# Altium schematic sheet BSPD.SchDoc
size A4; SheetNumber: 1; SheetTotal: 1
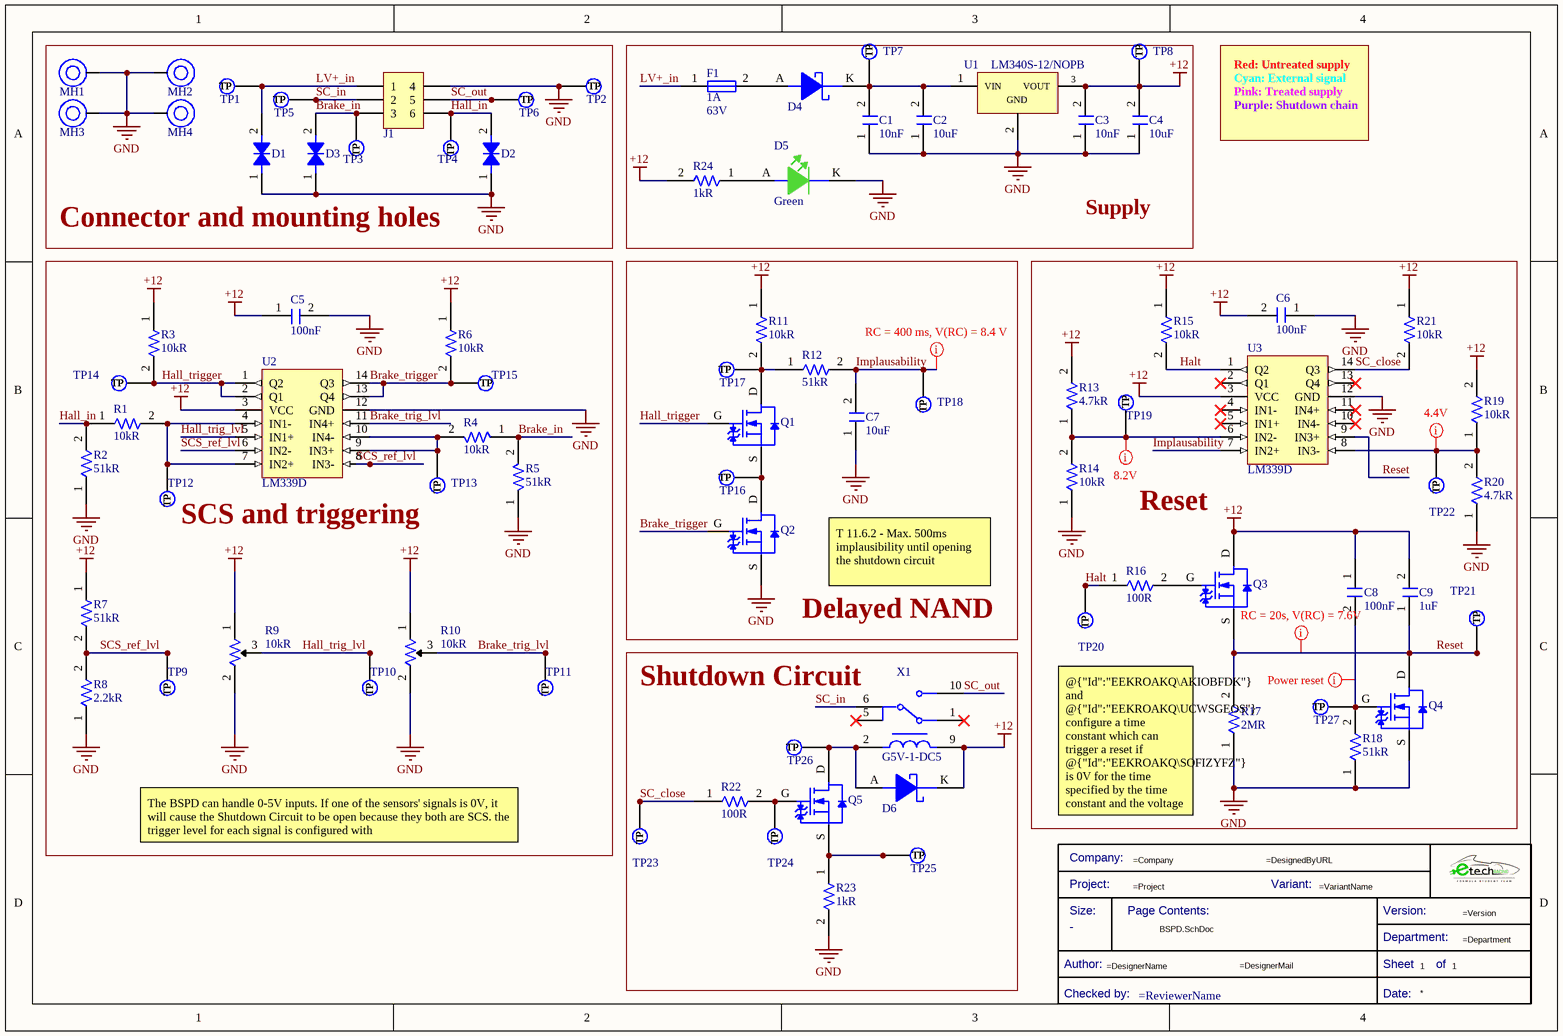
[diagram p0: BSPD.SchDoc]

## Parts
*  Title Block_template  (value not drawn)  (graphical)
C1  Capacitance: 10nF  [C1206FNPC-RW]  (hidden comment: 885012008055)
C2  Capacitance: 10uF  [C10u-50V-1210FNPMLCC-X7R]  (hidden comment: GRJ32ER71H106KE11L)
C3  Capacitance: 10nF  [C1206FNPC-RW]  (hidden comment: 885012008055)
C4  Capacitance: 10uF  [C10u-50V-1210FNPMLCC-X7R]  (hidden comment: GRJ32ER71H106KE11L)
C5  Capacitance: 100nF  [C1206FNPC-RW]  (hidden comment: 885012208058)
C6  Capacitance: 100nF  [C1206FNPC-RW]  (hidden comment: 885012208058)
C7  Capacitance: 10uF  [C1206FNPC-RW]  (hidden comment: 885012208018)
C8  Capacitance: 100nF  [C1206FNPC-RW]  (hidden comment: 885012208058)
C9  Capacitance: 1uF  [C1206FNPC-RW]  (hidden comment: 885012208036)
D1  824551301  [DTVS-DO-214AB]  (value not drawn)
D2  824501600  [DTVS-DO-214AC]  (value not drawn)
D3  824501600  [DTVS-DO-214AC]  (value not drawn)
D4  MBR0530  [DSC-SOD123]  (value not drawn)
D5  Color: Green  [LED_0805_WE]  (hidden comment: 150080VS75000)
D6  MBR0530  [DSC-SOD123]  (value not drawn)
F1  Current Rating: 1A  Voltage Rating (DC): 63V  [Fuse_1206]  (hidden comment: 0437001.WRA)
J1  J_NanoFit_2x3  [J_NanoFit_2x3]  (value not drawn)
MH1  Mounting_Hole_M3  [Mounting_Hole_M3]  (value not drawn)
MH2  Mounting_Hole_M3  [Mounting_Hole_M3]  (value not drawn)
MH3  Mounting_Hole_M3  [Mounting_Hole_M3]  (value not drawn)
MH4  Mounting_Hole_M3  [Mounting_Hole_M3]  (value not drawn)
Q1  CPH3455-TL-H  [TRT-NCH-3/35-CPH]  (value not drawn)
Q2  CPH3455-TL-H  [TRT-NCH-3/35-CPH]  (value not drawn)
Q3  CPH3455-TL-H  [TRT-NCH-3/35-CPH]  (value not drawn)
Q4  CPH3455-TL-H  [TRT-NCH-3/35-CPH]  (value not drawn)
Q5  CPH3455-TL-H  [TRT-NCH-3/35-CPH]  (value not drawn)
R1  Resistance: 10kR  [R1206FTK-W]  (hidden comment: CRCW120610K0FKEA)
R2  Resistance: 51kR  [R1206FTK-W]  (hidden comment: CRCW120610K0FKEA)
R3  Resistance: 10kR  [R1206FTK-W]  (hidden comment: CRCW120610K0FKEA)
R4  Resistance: 10kR  [R1206FTK-W]  (hidden comment: CRCW120610K0FKEA)
R5  Resistance: 51kR  [R1206FTK-W]  (hidden comment: CRCW120610K0FKEA)
R6  Resistance: 10kR  [R1206FTK-W]  (hidden comment: CRCW120610K0FKEA)
R7  Resistance: 51kR  [R1206FTK-W]  (hidden comment: CRCW120610K0FKEA)
R8  Resistance: 2.2kR  [R1206FTK-W]  (hidden comment: CR1206-FX-2201ELF)
R9  Resistance: 10kR  [R10k-VTR]  (hidden comment: 3296W-1-103LF)
R10  Resistance: 10kR  [R10k-VTR]  (hidden comment: 3296W-1-103LF)
R11  Resistance: 10kR  [R1206FTK-W]  (hidden comment: CRCW120610K0FKEA)
R12  Resistance: 51kR  [R1206FTK-W]  (hidden comment: CRCW120610K0FKEA)
R13  Resistance: 4.7kR  [R1206FTK-W]  (hidden comment: CRS1206-FX-4701ELF)
R14  Resistance: 10kR  [R1206FTK-W]  (hidden comment: CRCW120610K0FKEA)
R15  Resistance: 10kR  [R1206FTK-W]  (hidden comment: CRCW120610K0FKEA)
R16  Resistance: 100R  [R1206FTK-W]  (hidden comment: CRG1206F100R)
R17  Resistence: 2MR  [R1206FTK-W]  (hidden comment: HVC1206-2M0FT3)
R18  Resistance: 51kR  [R1206FTK-W]  (hidden comment: CRCW120610K0FKEA)
R19  Resistance: 10kR  [R1206FTK-W]  (hidden comment: CRCW120610K0FKEA)
R20  Resistance: 4.7kR  [R1206FTK-W]  (hidden comment: CRS1206-FX-4701ELF)
R21  Resistance: 10kR  [R1206FTK-W]  (hidden comment: CRCW120610K0FKEA)
R22  Resistance: 100R  [R1206FTK-W]  (hidden comment: CRG1206F100R)
R23  Resistance: 1kR  [R1206FTK-W]  (hidden comment: ERJT08J102V)
R24  Resistance: 1kR  [R0805FTK]  (hidden comment: CR0805-JW-102ELF)
TP1  TestPoint  [TestPoint]  (value not drawn)  (no BOM)
TP2  TestPoint  [TestPoint]  (value not drawn)  (no BOM)
TP3  TestPoint  [TestPoint]  (value not drawn)  (no BOM)
TP4  TestPoint  [TestPoint]  (value not drawn)  (no BOM)
TP5  TestPoint  [TestPoint]  (value not drawn)  (no BOM)
TP6  TestPoint  [TestPoint]  (value not drawn)  (no BOM)
TP7  TestPoint  [TestPoint]  (value not drawn)  (no BOM)
TP8  TestPoint  [TestPoint]  (value not drawn)  (no BOM)
TP9  TestPoint  [TestPoint]  (value not drawn)  (no BOM)
TP10  TestPoint  [TestPoint]  (value not drawn)  (no BOM)
TP11  TestPoint  [TestPoint]  (value not drawn)  (no BOM)
TP12  TestPoint  [TestPoint]  (value not drawn)  (no BOM)
TP13  TestPoint  [TestPoint]  (value not drawn)  (no BOM)
TP14  TestPoint  [TestPoint]  (value not drawn)  (no BOM)
TP15  TestPoint  [TestPoint]  (value not drawn)  (no BOM)
TP16  TestPoint  [TestPoint]  (value not drawn)  (no BOM)
TP17  TestPoint  [TestPoint]  (value not drawn)  (no BOM)
TP18  TestPoint  [TestPoint]  (value not drawn)  (no BOM)
TP19  TestPoint  [TestPoint]  (value not drawn)  (no BOM)
TP20  TestPoint  [TestPoint]  (value not drawn)  (no BOM)
TP21  TestPoint  [TestPoint]  (value not drawn)  (no BOM)
TP22  TestPoint  [TestPoint]  (value not drawn)  (no BOM)
TP23  TestPoint  [TestPoint]  (value not drawn)  (no BOM)
TP24  TestPoint  [TestPoint]  (value not drawn)  (no BOM)
TP25  TestPoint  [TestPoint]  (value not drawn)  (no BOM)
TP26  TestPoint  [TestPoint]  (value not drawn)  (no BOM)
TP27  TestPoint  [TestPoint]  (value not drawn)  (no BOM)
U1  LM340S-12/NOPB  [LDO_35V-1/12V-TO220]
U2  LM339D  [Array_4_Amp_LM339D]
U3  LM339D  [Array_4_Amp_LM339D]
X1  G5V-1-DC5  [Relay_G5V-1-DC5]

## Blocks framed on the sheet
Connector and mounting holes: D1-D3 J1 MH1-MH4 TP1-TP6
Supply: C1-C4 D4 D5 F1 R24 TP7 TP8 U1
SCS and triggering: C5 R1-R10 TP9-TP15 U2
Delayed NAND: C7 Q1 Q2 R11 R12 TP16-TP18
Reset: C6 C8 C9 Q3 Q4 R13-R21 TP19-TP22 TP27 U3
Shutdown Circuit: D6 Q5 R22 R23 TP23-TP26 X1

## Nets
+12: C3.2 C4.2 C5.1 C6.2 C8.1 C9.2 D6.K Q3.D R3.1 R6.1 R7.1 R9.1 R10.1 R11.1 R13.2 R15.1 R19.2 R21.1 R24.2 TP8.1(TP) U1.3(VOUT) U2.3(VCC) U3.3(VCC) X1.9
GND: C1.1 C2.1 C3.1 C4.1 C5.2 C6.1 C7.1 D1.1 D2.1 D3.1 D5.K J1.4 MH1.1 MH2.1 MH3.1 MH4.1 Q2.S Q4.S R2.1 R5.1 R8.1 R9.2 R10.2 R14.1 R17.1 R18.1 R20.1 R23.2 TP2.1(TP) U1.2(GND) U2.12(GND) U3.12(GND)
Brake_in: D3.2 J1.3 R4.1 R5.2 TP3.1(TP)
Brake_trig_lvl: R10.3 TP11.1(TP) U2.11(IN4+)
Brake_trigger: Q2.G R6.2 TP15.1(TP) U2.13(Q4) U2.14(Q3)
Hall_in: D2.2 J1.6 R1.1 R2.2 TP4.1(TP)
Hall_trig_lvl: R9.3 TP10.1(TP) U2.5(IN1+)
Hall_trigger: Q1.G R3.2 TP14.1(TP) U2.1(Q2) U2.2(Q1)
Halt: R15.2 R16.1 TP20.1(TP) U3.1(Q2)
Implausability: C7.2 R12.2 TP18.1(TP) U3.7(IN2+)
LV+_in: D1.2 F1.1 J1.1 TP1.1(TP)
Reset: C9.1 Q3.S Q4.D R17.2 TP21.1(TP) U3.9(IN3+)
SC_close: R21.2 R22.1 TP23.1(TP) U3.14(Q3)
SC_in: J1.2 TP5.1(TP) X1.6
SC_out: J1.5 TP6.1(TP) X1.10
SCS_ref_lvl: R7.2 R8.2 TP9.1(TP) U2.6(IN2-) U2.8(IN3-)
NetC1_2: C1.2 C2.2 D4.K TP7.1(TP) U1.1(VIN)
NetC8_2: C8.2 Q4.G R18.2 TP27.1(TP)
NetD4_A: D4.A F1.2
NetD5_A: D5.A R24.1
NetD6_A: D6.A Q5.D TP26.1(TP) X1.2
NetQ1_D: Q1.D R11.2 R12.1 TP17.1(TP)
NetQ1_S: Q1.S Q2.D TP16.1(TP)
NetQ3_G: Q3.G R16.2
NetQ5_G: Q5.G R22.2 TP24.1(TP)
NetQ5_S: Q5.S R23.1 TP25.1(TP)
NetR1_2: R1.2 TP12.1(TP) U2.4(IN1-) U2.7(IN2+)
NetR4_2: R4.2 TP13.1(TP) U2.9(IN3+) U2.10(IN4-)
NetR13_1: R13.1 R14.2 TP19.1(TP) U3.6(IN2-)
NetR19_1: R19.1 R20.2 TP22.1(TP) U3.8(IN3-)

Not connected (* = marked no-connect by the designer): U3 2(Q1)* 4(IN1-)* 5(IN1+)* 10(IN4-)* 11(IN4+)* 13(Q4)*; X1 1* 5*

## Layout directives
mark named RC = 400 ms, V(RC) = 8.4 V: Implausability
mark named 8.2V: NetR13_1
mark named 4.4V: NetR19_1
mark named RC = 20s, V(RC) = 7.6V: Reset
mark named Power reset: NetC8_2

## Notes on the sheet
- Cyan: External signal
- Red: Untreated supply
- Purple: Shutdown chain
- Pink: Treated supply
- T 11.6.2 - Max. 500ms implausibility until opening the shutdown circuit
- The BSPD can handle 0-5V inputs. If one of the sensors' signals is 0V, it will cause the Shutdown Circuit to be open because they both are SCS. the trigger level for each signal is configured with @{"Id":"EEKROAKQ\WAQVQDDE"} and @{"Id":"EEKROAKQ\GNIXORKW"} .
- @{"Id":"EEKROAKQ\AKIOBFDK"} and @{"Id":"EEKROAKQ\UCWSGEOS"} configure a time constant which can trigger a reset if @{"Id":"EEKROAKQ\SOFIZYFZ"} is 0V for the time specified by the time constant and the voltage reference achieved with @{"Id":"EEKROAKQ\XFDZNSBV"} and @{"Id":"EEKROAKQ\ALONRRDI"}. This is due to T 11.6.1
- (in symbol Title Block_template) Company:; Project:; Variant:; Size:; Page Contents:; Version:; Department:; Author:; Sheet; of; Checked by:; Date:

## Library data of the parts
* = Title Block_template: Standard Title Block; .Creator: GP; Category: Title Block; .PCBcheck: GP; .SCHcheck: GP; Checked by:: =ReviewerName; Size: -
C1 C3 = C10n-50V-1206FNPC-C0G/NP0: Cap Cer 10000PF 50V C0G/NP0 1206; Manufacturer: Wurth Electronics; Tolerance: 5%; .Creator: DO; Supplier 1: Mouser; Manufacturer Part Number: 885012008055; RoHS: Yes; Category: Ceramic Capacitors; Stock 1: 4648; Pricing 1: 1=0,40000, 10=0,35800, 50=0,35800, 100=0,32100, 1000=0,28400, 10000=0,17200 (USD); Mount: Surface Mount; Case/Package: 1206; Case Code (Metric): 3216; Case Code (Imperial): 1206; Min Operating Temperature: -55°C; Max Operating Temperature: 125°C; Packaging: Tape and Reel; Voltage Rating: 50V; Length: 0.126inch; Width: 0.063inch; Thickness: 0.053inch; ComponentLink1URL: https://katalog.we-online.de/pbs/datasheet/885012008055.pdf?src-supplier=Digi-Key; ComponentLink1Description: https://katalog.we-online.de/pbs/datasheet/885012008055.pdf?src-supplier=Digi-Key; Supplier Part Number 1: 710-885012008055; ComponentLink2Description: Where buy it; ComponentLink2URL: https://www.we-online.com/catalog/en/WCAP-CSGP-50VDC#885012207092
C2 C4 = C10u-50V-1210FNPMLCC-X7R: Multilayer Ceramic Capacitors MLCC - SMD/SMT 1210 10uF 50volts X7R +/-10% Soft Term; Manufacturer: Murata; Voltage Rating: 50V; Tolerance: 10%; .Creator: DR; Supplier 1: Avnet; Manufacturer Part Number: GRJ32ER71H106KE11L; RoHS: Yes; Category: Ceramic Capacitors; Stock 1: 19000; Pricing 1: 1000=0,33327, 2000=0,32389, 4000=0,31450, 6000=0,30511, 8000=0,29572 (USD); Mount: Surface Mount; Case/Package: 1210; Case Code (Metric): 3225; Case Code (Imperial): 1210; Min Operating Temperature: -55°C; Max Operating Temperature: 125°C; Packaging: Tape and Reel; Features: Soft Termination; Length: 0.126inch; Width: 0.098inch; Thickness: 0.11inch; RoHS Compliant: Yes; ComponentLink1URL: https://eu.mouser.com/datasheet/2/281/GRJ32ER71H106KE11_01-1977929.pdf; ComponentLink1Description: Datasheet; Supplier Part Number 1: GRJ32ER71H106KE11L
C5 C6 C8 = C100n-25V-1206FNPC-X7R: Cap Cer 0.1UF 25V X7R 1206; Manufacturer: Wurth Electronics; Tolerance: 10%; .Creator: DO; Category: Capacitor; ComponentLink1Description: Datasheet; ComponentLink1URL: https://www.we-online.com/catalog/datasheet/885012208058.pdf; ComponentLink2Description: Where buy it; ComponentLink2URL: https://www.we-online.com/catalog/en/WCAP-CSGP-25VDC#885012208058; Supplier 1: Digi-Key; Manufacturer Part Number: 885012208058; RoHS: Yes; Stock 1: 4375; Pricing 1: 1=0,11000, 10=0,10100, 100=0,09100, 500=0,08000 (USD); Mount: Surface Mount; Case/Package: 1206; Case Code (Metric): 3216; Case Code (Imperial): 1206; Min Operating Temperature: -55°C; Max Operating Temperature: 125°C; Packaging: Tape and Reel; Voltage Rating: 25V; Length: 0.126inch; Width: 0.063inch; Thickness: 0.035inch; RoHS Compliant: Yes; ComponentLink3URL: https://katalog.we-online.de/pbs/datasheet/885012208058.pdf?src-supplier=Digi-Key; ComponentLink3Description: https://katalog.we-online.de/pbs/datasheet/885012208058.pdf?src-supplier=Digi-Key; Supplier Part Number 1: 732-8109-1-ND
C7 = C10u-10V-1206FNPC-X7R: Cap, 10ΜF, 10V, 10%, X7R, 1206; Manufacturer 1: Wurth Electronics; .Creator: GP; Supplier 1: Digi-Key; Manufacturer Part Number 1: 885012208018; RoHS: Yes; Category: Ceramic Capacitors; Stock 1: 7; Pricing 1: 1=0,66000, 10=0,59800, 100=0,53600, 500=0,47400 (USD); Mount: Surface Mount; Case/Package: 1206; Case Code (Metric): 3216; Case Code (Imperial): 1206; Min Operating Temperature: -55°C; Max Operating Temperature: 125°C; Packaging: Tape and Reel; Voltage Rating: 10V; Tolerance: 10%; Length: 0.126inch; Width: 0.063inch; Thickness: 0.075inch; RoHS Compliant: Yes; ComponentLink1URL: http://www.farnell.com/datasheets/2031895.pdf?src-supplier=Farnell; ComponentLink1Description: http://www.farnell.com/datasheets/2031895.pdf?src-supplier=Farnell; ComponentLink2URL: https://katalog.we-online.de/pbs/datasheet/885012208018.pdf?src-supplier=Digi-Key; ComponentLink2Description: https://katalog.we-online.de/pbs/datasheet/885012208018.pdf?src-supplier=Digi-Key; ComponentLink3URL: http://www.farnell.com/datasheets/2031895.pdf?src-supplier=Newark; ComponentLink3Description: http://www.farnell.com/datasheets/2031895.pdf?src-supplier=Newark; Supplier Part Number 1: 732-7565-1-ND; ComponentLink4Description: Wurth Elektronik; ComponentLink4URL: https://www.we-online.com/catalog/en/WCAP-CSGP-10VDC?sq=885012208018#885012208018
C9 = C1u-16V-1206FNPC-X7R: Cap Cer 1UF 16V X7R 1206; Manufacturer: Wurth Electronics; Tolerance: 10%; .Creator: GP; Category: Capacitor; ComponentLink1Description: Datasheet; ComponentLink1URL: https://www.we-online.com/catalog/datasheet/885012208036.pdf; ComponentLink2Description: Where buy it; ComponentLink2URL: https://www.we-online.com/catalog/en/WCAP-CSGP-16VDC#885012208036; Supplier 1: Mouser; Manufacturer Part Number: 885012208036; RoHS: Yes; Stock 1: 5938; Pricing 1: 1=0,15000, 10=0,13900, 50=0,13900, 100=0,12400, 500=0,11000, 1000=0,11000, 3000=0,09100, 10000=0,09100 (USD); Mount: Surface Mount; Case/Package: 1206; Case Code (Metric): 3216; Case Code (Imperial): 1206; Min Operating Temperature: -55°C; Max Operating Temperature: 125°C; Packaging: Tape and Reel; Voltage Rating: 16V; Length: 0.126inch; Width: 0.063inch; Thickness: 0.051inch; RoHS Compliant: Yes; Supplier Part Number 1: 710-885012208036
D1 = DTVS-40V-DO-214AB: TVS diode [Würth Elektronik] 824551301 TVS diode; Manufacturer: Wurth Electronics; Number of Bidirectional Channels: 1; Reverse Standoff Voltage: 30V; Min Breakdown Voltage: 35.05V; Clamping Voltage: 48.4V; Peak Pulse Power: 3kW; Power Line Protection: No; Polarity: Bidirectional; Peak Pulse Current: 62A; .Creator: DO; ComponentLink2Description: Where buy it; ComponentLink2URL: https://www.we-online.com/catalog/en/WE-TVSP?sq=824551301#824551301; Supplier 1: RSComponents; Manufacturer Part Number: 824551301; RoHS: Yes; Category: TVS Diodes; Stock 1: 1; Pricing 1: 10=1,72500, 50=1,54700, 100=1,45300, 250=1,35100, 500=1,15000 (USD); Mount: Surface Mount; Number of Pins: 2; Min Operating Temperature: -65°C; Max Operating Temperature: 150°C; Packaging: Cut Tape; Max Breakdown Voltage: 35.05V; Resistor Type: Zener; REACH SVHC: Unknown; RoHS Compliant: Yes; ComponentLink1URL: http://www.farnell.com/datasheets/2036459.pdf?src-supplier=Element14; ComponentLink1Description: http://www.farnell.com/datasheets/2036459.pdf?src-supplier=Element14; Supplier Part Number 1: 9217092P
D2 D3 = DTVS-6V-DO-214AC: TVS diode [Würth Elektronik] 824501600 TVS diode; Manufacturer: Wurth Electronics; Number of Bidirectional Channels: 1; Reverse Standoff Voltage: 6V; Min Breakdown Voltage: 7.02V; Clamping Voltage: 10.3V; Peak Pulse Power: 400W; Power Line Protection: No; Polarity: Bidirectional; Peak Pulse Current: 38.8A; .Creator: DO; ComponentLink1Description: Where buy it; ComponentLink1URL: https://www.we-online.com/catalog/en/WE-TVSP?sq=824501600#824501600; Supplier 1: Mouser; Manufacturer Part Number: 824501600; RoHS: Yes; Category: TVS Diodes; Stock 1: 780; Pricing 1: 1=0,28000, 10=0,26100, 50=0,26100, 100=0,23400, 500=0,20400, 1000=0,17400, 10000=0,17400 (USD); Mount: Surface Mount; Number of Pins: 2; Min Operating Temperature: -65°C; Max Operating Temperature: 150°C; Packaging: Cut Tape; Max Breakdown Voltage: 7.02V; Resistor Type: Zener; REACH SVHC: Unknown; RoHS Compliant: Yes; ComponentLink2URL: http://www.farnell.com/datasheets/2036401.pdf?src-supplier=Element14; ComponentLink2Description: http://www.farnell.com/datasheets/2036401.pdf?src-supplier=Element14; Supplier Part Number 1: 710-824501600; ComponentLink3URL: https://katalog.we-online.de/pbs/datasheet/824501600.pdf?src-supplier=Digi-Key; ComponentLink3Description: https://katalog.we-online.de/pbs/datasheet/824501600.pdf?src-supplier=Digi-Key
D4 D6 = DSC-0.5/30-SOD123: VR=30V IF=500mA 30pF P=410mW; Element Configuration: Single; Forward Voltage: 430mV; Peak Non-Repetitive Surge Current: 5.5A; Average Rectified Current: 500mA; Max Reverse Leakage Current: 130uA; Max Reverse Voltage (DC): 30V; Polarity: Standard; .Creator: GP; Category: Diode; ComponentLink1Description: Datasheet; ComponentLink1URL: *; ComponentLink2Description: Where buy it; ComponentLink2URL: *; Supplier 1: Newark; Stock 1: 9; Pricing 1: 1=0,34400, 10=0,23900, 100=0,12200, 500=0,10000 (USD); Mount: Surface Mount; Contact Plating: Tin,Matte; Weight: 0.03g; Package Quantity: 1; Max Surge Current: 5.5A; Forward Current: 500mA; Max Reverse Current: 130uA; Max Repetitive Reverse Voltage (Vrrm): 30V; Max Forward Surge Current (Ifsm): 5.5A; Voltage Rating (DC): 30V; Current Rating: 500mA; Output Current: 500mA; Series: -; Length: 2.7mm; Width: 1.6mm; Height: 1.03mm; Radiation Hardening: No; RoHS Compliant: Yes; REACH SVHC: No SVHC; Lead Free: Lead Free; ComponentLink3URL: https://datasheet.ciiva.com/30479/0900766b810e2512-30479401.pdf?src-supplier=RSComponents; ComponentLink3Description: https://datasheet.ciiva.com/30479/0900766b810e2512-30479401.pdf?src-supplier=RSComponents; ComponentLink4URL: https://datasheet.ciiva.com/34301/974753-34301826.pdf?src-supplier=Jameco; ComponentLink4Description: https://datasheet.ciiva.com/34301/974753-34301826.pdf?src-supplier=Jameco; ComponentLink5URL: https://datasheet.ciiva.com/910/mbr0530-910516.pdf?src-supplier=Digi-Key; ComponentLink5Description: https://datasheet.ciiva.com/910/mbr0530-910516.pdf?src-supplier=Digi-Key; ComponentLink6URL: https://datasheet.ciiva.com/25931/mbr0530-25931989.pdf?src-supplier=Avnet+Europe; ComponentLink6Description: https://datasheet.ciiva.com/25931/mbr0530-25931989.pdf?src-supplier=Avnet+Europe; ComponentLink7URL: https://datasheet.ciiva.com/8300/mbr0530-8300905.pdf?src-supplier=Avnet; ComponentLink7Description: https://datasheet.ciiva.com/8300/mbr0530-8300905.pdf?src-supplier=Avnet; ComponentLink8URL: https://datasheet.ciiva.com/17318/mbr0530-17318568.pdf?src-supplier=Future+Electronics; ComponentLink8Description: https://datasheet.ciiva.com/17318/mbr0530-17318568.pdf?src-supplier=Future+Electronics; ComponentLink9URL: https://datasheet.ciiva.com/15144/getdatasheetpartid-86760-15144598.pdf?src-supplier=Verical; ComponentLink9Description: https://datasheet.ciiva.com/15144/getdatasheetpartid-86760-15144598.pdf?src-supplier=Verical; ComponentLink10URL: https://datasheet.ciiva.com/910/mbr0530-910518.pdf?src-supplier=Digi-Key; ComponentLink10Description: https://datasheet.ciiva.com/910/mbr0530-910518.pdf?src-supplier=Digi-Key; Supplier Part Number 1: 15R3453
D5 = LEDVS-0805-40: Led, Green, 570 Nm, 2 V, 30 Ma, 40 Mcd Rohs Compliant: Yes; Manufacturer 1: Wurth Electronics; Luminous Intensity: 40mcd; Forward Current: 30mA; Forward Voltage: 2V; Viewing Angle: 140°; Wavelength: 570nm; Lens Style: Clear,Rectangular; Test Current: 20mA; .Creator: DR; ComponentLink1Description: Datasheet; ComponentLink1URL: https://www.we-online.com/catalog/datasheet/150080VS75000.pdf; ComponentLink2Description: Where buy it; ComponentLink2URL: https://katalog.we-online.de/en/led/WL-SMCW/150080VS75000; Supplier 1: RSComponents; Manufacturer Part Number 1: 150080VS75000; RoHS: Yes; Category: LEDs; Stock 1: 850; Pricing 1: 50=0,19300, 500=0,12900, 1000=0,12300, 2000=0,11700, 4000=0,11100 (USD); Mount: Surface Mount; Case/Package: 0805; Case Code (Metric): 2012; Case Code (Imperial): 0805; Min Operating Temperature: -40°C; Max Operating Temperature: 85°C; Package Quantity: 4000; Packaging: Tape and Reel; Dominant Wavelength: 570nm; Length: 2mm; Width: 1.25mm; Height: 0.7mm; REACH SVHC: Unknown; ComponentLink3URL: https://datasheet.ciiva.com/22656/150080vs75000-22656966.pdf?src-supplier=Element14; ComponentLink3Description: https://datasheet.ciiva.com/22656/150080vs75000-22656966.pdf?src-supplier=Element14; ComponentLink4URL: https://datasheet.ciiva.com/29279/759437-da-01-en-chipled-0805-w-kl-h-gruen-150080vs7500-29279047.pdf?src-supplier=Conrad; ComponentLink4Description: https://datasheet.ciiva.com/29279/759437-da-01-en-chipled-0805-w-kl-h-gruen-150080vs7500-29279047.pdf?src-supplier=Conrad; ComponentLink5URL: https://datasheet.ciiva.com/29563/150080vs75000-29563018.pdf?src-supplier=Digi-Key; ComponentLink5Description: https://datasheet.ciiva.com/29563/150080vs75000-29563018.pdf?src-supplier=Digi-Key; Supplier Part Number 1: 8154237
F1 = Fuse_1A_63V_1206: Fuse Chip Fast Acting 1A 63V SMD Solder Pad 1206 Ceramic T/R Automotive; Manufacturer: Littelfuse; Fuse Type: Board Mount (Cartridge Style Excluded); Approvals: CSA,cURus; .Creator: DO; Supplier 1: Digi-Key; Manufacturer Part Number: 0437001.WRA; RoHS: Yes; Category: Fuses; Stock 1: 5820; Pricing 1: 1=1,52000, 5=1,47000, 10=1,37600, 50=1,13860, 100=0,94880, 250=0,92508, 500=0,78276, 1000=0,68788 (USD); Mount: Surface Mount; Case/Package: 1206; Case Code (Imperial): 1206; Case Code (Metric): 3216; Min Operating Temperature: -55°C; Max Operating Temperature: 150°C; Packaging: Tape and Reel; Voltage Rating (AC): 63V; ComponentLink1URL: https://www.littelfuse.com/~/media/electronics/datasheets/fuses/littelfuse_fuse_437a_datasheet.pdf.pdf?src-supplier=Digi-Key; ComponentLink1Description: https://www.littelfuse.com/~/media/electronics/datasheets/fuses/littelfuse_fuse_437a_datasheet.pdf.pdf?src-supplier=Digi-Key; Supplier Part Number 1: F10001CT-ND; ComponentLink2Description: Where buy it; ComponentLink2URL: https://www.mouser.es/ProductDetail/Littelfuse/0437001WRA?qs=DXv0QSHKF4z9CJhPXjxR%252BA%3D%3D
Q1-Q5 = TRT-NCH-3/35-CPH: CPH3455-TL-H N-channel MOSFET Transistor; 3 A; 35 V; 3-Pin CPH; Manufacturer: ON Semiconductor; Rds On Max: 104mR; Input Capacitance: 186pF; Rise Time: 4.7ns; Drain to Source Voltage (Vdss): 35V; Continuous Drain Current (ID): 3A; Max Power Dissipation: 1W; Drain to Source Resistance: 108mR; Turn-On Delay Time: 4.2ns; Turn-Off Delay Time: 15ns; Fall Time: 5.7ns; Element Configuration: Single; Gate to Source Voltage (Vgs): 20V; .Creator: GP; Category: Transistor; ComponentLink1Description: Datasheet; ComponentLink1URL: https://docs.rs-online.com/5847/0900766b812d514d.pdf; ComponentLink2Description: Where buy it; ComponentLink2URL: https://es.rs-online.com/web/p/mosfet/8009989; Supplier 1: RSComponents; Manufacturer Part Number: CPH3455-TL-H; RoHS: Yes; Stock 1: 1; Pricing 1: 50=0,50400 (USD); Case/Package: SC; Number of Pins: 3; Min Operating Temperature: -55°C; Max Operating Temperature: 150°C; Package Quantity: 3000; Packaging: Tape and Reel; Drain to Source Breakdown Voltage: 35V; Power Dissipation: 1W; Polarity: N-CHANNEL; Series: -; Length: 2.9mm; Width: 1.6mm; Height: 0.9mm; Lead Free: Lead Free; Halogen Free: Halogen Free; RoHS Compliant: Yes; ComponentLink3URL: https://datasheet.ciiva.com/947/cph3455-d-947201.pdf?src-supplier=Digi-Key; ComponentLink3Description: https://datasheet.ciiva.com/947/cph3455-d-947201.pdf?src-supplier=Digi-Key; ComponentLink4URL: https://datasheet.ciiva.com/4444/cph3455-d-91653-4444616.pdf?src-supplier=Mouser; ComponentLink4Description: https://datasheet.ciiva.com/4444/cph3455-d-91653-4444616.pdf?src-supplier=Mouser; ComponentLink5URL: https://datasheet.ciiva.com/11164/cph3455-d-11164889.pdf?src-supplier=Avnet; ComponentLink5Description: https://datasheet.ciiva.com/11164/cph3455-d-11164889.pdf?src-supplier=Avnet; Supplier Part Number 1: 8009989
R1 R3 R4 R6 R11 R14 R15 R19 R21 = R10k-1206FTK: Res Thick Film 1206 10K Ohm 1% 0.25W(1/4W) +/-100ppm/ßC Pad SMD Automotive T/R; Temperature Coefficient: 100ppm/°C; Voltage Rating: 200V; .Creator: GP; Category: Resistor; ComponentLink1Description: Datasheet; ComponentLink1URL: https://docs.rs-online.com/bca8/A700000006404581.pdf; ComponentLink2Description: Where buy it; ComponentLink2URL: https://es.rs-online.com/web/p/resistencias-de-montaje-en-superficie/6791765; Supplier 1: Allied Electronics; Case/Package: 1206; Number of Pins: 2; Contact Plating: Tin; Weight: 0.000353oz; Case Code (Metric): 3216; Case Code (Imperial): 1206; Package Shape: Rectangular; Size Code: 1206; Terminal Finish: Tin; Resistor Type: Thick Film; Package Quantity: 10; Number of Terminations: 2; Termination: SMD/SMT; Voltage Rating (DC): 200V; Features: Automotive AEC-Q200; Series: CRCW; Construction: Rectangular; Resistance Tolerance: 1%; Working Voltage: 200V; Length: 3.2mm; Width: 0.063inch; Height: 0.55mm; Depth: 1.6mm; Radiation Hardening: No; Lead Free: Lead Free; RoHS Compliant: Yes; REACH SVHC: Unknown; Military Standard: Not; Supplier Part Number 1: 70201262
R2 R5 R7 R12 R18 = R51k-1206FTK: Res Thick Film 1206 51K Ohm 1% 1/4W ±100ppm/°C Molded SMD SMD Punched Carrier T/R; Manufacturer: Panasonic; Manufacturer Part Number: ERJ-S08F5102V; Power Rating: 250mW; Voltage Rating: 150V; Voltage Rating (DC): 200V; Current Rating: 2A; .Creator: DO; Category: Resistor; ComponentLink1Description: Datasheet; ComponentLink1URL: https://docs.rs-online.com/bca8/A700000006404581.pdf; ComponentLink2Description: Where buy it; ComponentLink2URL: https://es.rs-online.com/web/p/resistencias-de-montaje-en-superficie/6791765; Supplier 1: Mouser; RoHS: Yes; Stock 1: 4091; Pricing 1: 1=0,31000, 10=0,26700, 50=0,26700, 100=0,10700, 1000=0,05100, 10000=0,03400 (USD); Mount: Surface Mount; Case/Package: 1206; Case Code (Metric): 3216; Case Code (Imperial): 1206; Contact Plating: Tin; Min Operating Temperature: -55°C; Max Operating Temperature: 155°C; Packaging: Tape and Reel; Tolerance: 1%; Package Quantity: 5000; Resistor Type: Thick Film; Number of Terminations: 2; Temperature Coefficient: 100ppm/°C; Max Power Dissipation: 250mW; Features: Anti-Sulfur; Series: ERJ; Construction: Rectangular; Length: 3.2mm; Width: 0.063inch; Height: 0.028inch; Depth: 1.6mm; Military Standard: Not; Lead Free: Lead Free; RoHS Compliant: Yes; ComponentLink3URL: https://datasheet.ciiva.com/24023/aoa0000ce5-24023518.pdf?src-supplier=Mouser; ComponentLink3Description: https://datasheet.ciiva.com/24023/aoa0000ce5-24023518.pdf?src-supplier=Mouser; ComponentLink4URL: https://datasheet.ciiva.com/9189/aoa0000ce5-9189211.pdf?src-supplier=Avnet; ComponentLink4Description: https://datasheet.ciiva.com/9189/aoa0000ce5-9189211.pdf?src-supplier=Avnet; Supplier Part Number 1: 667-ERJ-S08F5102V
R8 = R2.2K-1206FTK: Res Thick Film 1206 2.2K Ohm 1% 1/4W ±100ppm/°C Molded SMD SMD Paper Tape on Plastic Reel; Manufacturer 1: Bourns; Power Rating: 250mW; Voltage Rating: 200V; .Creator: AC; Supplier 1: Digi-Key; Manufacturer Part Number 1: CR1206-FX-2201ELF; RoHS: Yes; Category: Chip SMD Resistors; Stock 1: 150; Pricing 1: 1=0,10000, 10=0,04200, 100=0,01700, 1000=0,00762, 2500=0,00661 (USD); Mount: Surface Mount; Case/Package: 1206; Number of Pins: 2; Contact Plating: Tin; Case Code (Metric): 3216; Case Code (Imperial): 1206; Min Operating Temperature: -55°C; Max Operating Temperature: 155°C; Tolerance: 1%; Resistor Type: Thick Film; Temperature Coefficient: 100ppm/°C; Packaging: Tape and Reel; Package Quantity: 5000; Number of Terminations: 2; Termination: SMD/SMT; Max Power Dissipation: 250mW; Voltage Rating (DC): 200V; Features: Moisture Resistant; Series: CR1206; Resistance Tolerance: 1%; Construction: Rectangular; Technology: THICK FILM; Length: 3.2mm; Width: 1.6mm; Height: 0.6mm; Depth: 1.6mm; Thickness: 610um; Radiation Hardening: No; REACH SVHC: No SVHC; Military Standard: Not; RoHS Compliant: Yes; ComponentLink1URL: https://datasheet.ciiva.com/11809/0900766b80fcdb72-11809898.pdf?src-supplier=RSComponents; ComponentLink1Description: https://datasheet.ciiva.com/11809/0900766b80fcdb72-11809898.pdf?src-supplier=RSComponents; ComponentLink2URL: https://datasheet.ciiva.com/9123/chpreztr-9123227.pdf?src-supplier=Avnet; ComponentLink2Description: https://datasheet.ciiva.com/9123/chpreztr-9123227.pdf?src-supplier=Avnet; ComponentLink3URL: https://datasheet.ciiva.com/16770/70154685-16770447.pdf?src-supplier=Allied+Electronics; ComponentLink3Description: https://datasheet.ciiva.com/16770/70154685-16770447.pdf?src-supplier=Allied+Electronics; ComponentLink4URL: https://datasheet.ciiva.com/7985/1856384-7985879.pdf?src-supplier=Element14; ComponentLink4Description: https://datasheet.ciiva.com/7985/1856384-7985879.pdf?src-supplier=Element14; ComponentLink5URL: https://datasheet.ciiva.com/22693/1902866-22693258.pdf?src-supplier=Element14; ComponentLink5Description: https://datasheet.ciiva.com/22693/1902866-22693258.pdf?src-supplier=Element14; Supplier Part Number 1: CR1206-FX-2201ELFCT-ND; ComponentLink6Description: RS; ComponentLink6URL: https://es.rs-online.com/web/p/resistencias-fijas-para-montaje-en-superficie/7409097/
R9 R10 = R10k-VTR: Trimmer, Cermet, Rest 10 Kilohms, PCB, 25 Turns, Pwr-Rtg 0.5W, 3296 Series; Manufacturer: Bourns; Tolerance: 10%; Power Rating: 500mW; Number of Turns: 25; Temperature Coefficient: 100ppm/°C; Insulation Resistance: 1GR; .Creator: DO; Supplier 1: RSComponents; Manufacturer Part Number: 3296W-1-103LF; RoHS: Yes; Category: Variable Resistors and Potentiometers; Stock 1: 3300; Pricing 1: 50=2,54800, 100=2,31900, 200=2,14000, 300=1,88400, 500=1,55300 (USD); Mount: PCB,Through Hole; Weight: 0.03oz; Color: Blue; Contact Plating: Tin,Matte; Min Operating Temperature: -55°C; Max Operating Temperature: 125°C; Packaging: Rail/Tube; Package Quantity: 50; Termination: Pin; Resistor Type: Cermet; Technology: CERMET; Taper: Linear; Max Power Dissipation: 500mW; Series: 3296; Resistance Tolerance: 10%; Length: 9.53mm; Width: 9.53mm; Height: 0.395inch; Depth: 4.83mm; Radiation Hardening: No; REACH SVHC: No SVHC; Military Standard: Not; Lead Free: Lead Free; RoHS Compliant: Yes; ComponentLink1URL: https://datasheet.ciiva.com/19454/853572-19454866.pdf?src-supplier=Jameco; ComponentLink1Description: https://datasheet.ciiva.com/19454/853572-19454866.pdf?src-supplier=Jameco; ComponentLink2URL: https://datasheet.ciiva.com/11830/0900766b8069ccf4-11830871.pdf?src-supplier=RSComponents; ComponentLink2Description: https://datasheet.ciiva.com/11830/0900766b8069ccf4-11830871.pdf?src-supplier=RSComponents; ComponentLink3URL: https://datasheet.ciiva.com/29122/447277-da-01-en-trimmer-tht3296w-1-103lf-10k-0-5w-29122362.pdf?src-supplier=Conrad; ComponentLink3Description: https://datasheet.ciiva.com/29122/447277-da-01-en-trimmer-tht3296w-1-103lf-10k-0-5w-29122362.pdf?src-supplier=Conrad; ComponentLink4URL: https://datasheet.ciiva.com/26913/3296w-1-103lf-26913885.pdf?src-supplier=IIIC; ComponentLink4Description: https://datasheet.ciiva.com/26913/3296w-1-103lf-26913885.pdf?src-supplier=IIIC; ComponentLink5URL: https://datasheet.ciiva.com/1131/1815117-1131273.pdf?src-supplier=Element14; ComponentLink5Description: https://datasheet.ciiva.com/1131/1815117-1131273.pdf?src-supplier=Element14; ComponentLink6URL: https://datasheet.ciiva.com/18411/70153578-18411561.pdf?src-supplier=Allied+Electronics; ComponentLink6Description: https://datasheet.ciiva.com/18411/70153578-18411561.pdf?src-supplier=Allied+Electronics; ComponentLink7URL: https://datasheet.ciiva.com/3266/3296-3266187.pdf?src-supplier=Avnet; ComponentLink7Description: https://datasheet.ciiva.com/3266/3296-3266187.pdf?src-supplier=Avnet; ComponentLink8URL: https://datasheet.ciiva.com/30093/3296-30093899.pdf?src-supplier=Onlinecomponents.com; ComponentLink8Description: https://datasheet.ciiva.com/30093/3296-30093899.pdf?src-supplier=Onlinecomponents.com; ComponentLink9URL: https://datasheet.ciiva.com/2156/3296-2156893.pdf?src-supplier=Digi-Key; ComponentLink9Description: https://datasheet.ciiva.com/2156/3296-2156893.pdf?src-supplier=Digi-Key; ComponentLink10URL: https://datasheet.ciiva.com/14173/ew3296-dat-e-14173022.pdf?src-supplier=Distrelec; ComponentLink10Description: https://datasheet.ciiva.com/14173/ew3296-dat-e-14173022.pdf?src-supplier=Distrelec; Supplier Part Number 1: 1673377; ComponentLink11Description: Where buy it; ComponentLink11URL: https://es.rs-online.com/web/p/potenciometros-de-ajuste/5219647
R13 R20 = R4.7K-1206FTK: Res Thick Film 1206 4.7K Ohm 1% 1/2W ±100ppm/°C Molded SMD T/R; Manufacturer 1: Bourns JW Miller; Voltage Rating: 400V; Power Rating: 500mW; .Creator: AC; Supplier 1: Digi-Key; RoHS: Yes; Category: Chip SMD Resistors; Pricing 1: 1=0,42000, 10=0,35400, 100=0,13850, 1000=0,05796, 2500=0,05313 (USD); Mount: Surface Mount; Case/Package: 1206; Case Code (Metric): 3016; Case Code (Imperial): 1206; Min Operating Temperature: -55°C; Max Operating Temperature: 155°C; Packaging: Cut Tape; Resistor Type: Thick Film; Number of Terminations: 2; Termination: SMD/SMT; Working Voltage: 400V; Voltage Rating (DC): 400V; Tolerance: 1%; Max Power Dissipation: 500mW; Temperature Coefficient: 100ppm/°C; Length: 0.122inch; Width: 0.063inch; Height: 0.026inch; REACH SVHC: No SVHC; ComponentLink1URL: https://datasheet.ciiva.com/48986/70483705-48986735.pdf?src-supplier=Allied+Electronics; ComponentLink1Description: https://datasheet.ciiva.com/48986/70483705-48986735.pdf?src-supplier=Allied+Electronics; Supplier Part Number 1: CRS1206-FX-4701ELFCT-ND; ComponentLink3Description: RS; ComponentLink3URL: https://es.rs-online.com/web/p/resistencias-de-montaje-en-superficie/8672965; Manufacturer Part Number 1: CRS1206-FX-4701ELF
R16 R22 = R100-1206FTK: Res Thick Film 1206 100 Ohm 1% 0.25W(1/4W) ±200ppm/C Pad SMD T/R; Manufacturer: TE Connectivity; Temperature Coefficient: 200ppm/°C; Max Power Dissipation: 250mW; Voltage Rating: 200V; Number of Resistors: 1; .Creator: AC; Category: Resistor; ComponentLink1Description: Datasheet; ComponentLink1URL: https://docs.rs-online.com/7aab/0900766b815b7339.pdf; ComponentLink2Description: Where buy it; ComponentLink2URL: https://es.rs-online.com/web/p/resistencias-de-montaje-en-superficie/2232120; Supplier 1: Digi-Key; Manufacturer Part Number: CRG1206F100R; RoHS: Yes; Stock 1: 13476; Pricing 1: 1=0,10000, 10=0,07600, 100=0,02920, 1000=0,01285, 2500=0,01110 (USD); Mount: Surface Mount; Case/Package: 1206; Case Code (Imperial): 1206; Case Code (Metric): 3216; Weight: 0.000571oz; Min Operating Temperature: -55°C; Max Operating Temperature: 125°C; Tolerance: 1%; Resistor Type: Thick Film; Packaging: Tape and Reel; Package Quantity: 5000; Number of Terminations: 2; Series: CRG, Neohm; Power Rating: 250mW; Termination: Solder; Technology: THICK FILM; Length: 3.1mm; Width: 1.55mm; Height: 0.55mm; Depth: 1.55mm; Radiation Hardening: No; RoHS Compliant: Yes; ELV: Compliant; ComponentLink3URL: https://datasheet.ciiva.com/11808/0900766b800a696e-11808648.pdf?src-supplier=RSComponents; ComponentLink3Description: https://datasheet.ciiva.com/11808/0900766b800a696e-11808648.pdf?src-supplier=RSComponents; ComponentLink4URL: https://datasheet.ciiva.com/16763/70063020-16763547.pdf?src-supplier=Allied+Electronics; ComponentLink4Description: https://datasheet.ciiva.com/16763/70063020-16763547.pdf?src-supplier=Allied+Electronics; ComponentLink5URL: https://datasheet.ciiva.com/5562/eng-ds-1773204-g-5562604.pdf?src-supplier=Mouser; ComponentLink5Description: https://datasheet.ciiva.com/5562/eng-ds-1773204-g-5562604.pdf?src-supplier=Mouser; Supplier Part Number 1: A106068CT-ND
R17 = R2M-1206FTK: Res Thick Film 1206 2M Ohm 1% 0.3W ±100ppm/C Pad SMD T/R; Manufacturer: TT Welwyn; Power Rating: 300mW; Voltage Rating: 1kV; Temperature Coefficient: 100ppm/°C; .Creator: DO; ComponentLink1Description: Datasheet; ComponentLink1URL: https://www.murata.com/en-eu/api/pdfdownloadapi?cate=cgsubHighVoltageResistors&partno=MHR0307SA205G20; Supplier 1: Future Electronics; Manufacturer Part Number: HVC1206-2M0FT3; RoHS: Yes; Category: Uncategorized; Pricing 1: 3000=1,11000 (USD); Case Code (Metric): 3216; Case Code (Imperial): 1206; Resistance: 2MR; Tolerance: 1%; Packaging: Cut Tape; Resistor Type: Thick Film; Voltage Rating (DC): 1kV; REACH SVHC: No SVHC; RoHS Compliant: Yes; ComponentLink2URL: https://datasheet.ciiva.com/28677/1720556-28677405.pdf?src-supplier=Element14; ComponentLink2Description: https://datasheet.ciiva.com/28677/1720556-28677405.pdf?src-supplier=Element14; Supplier Part Number 1: 6119491
R23 = R1k-1206FTK: Res Thick Film 1206 1K Ohm 5% 0.33W(1/3W) ±200ppm/C Pad SMD Automotive T/R; Manufacturer: Panasonic; Temperature Coefficient: 200ppm/°C; Power Rating: 330mW; Voltage Rating: 200V; Max Power Dissipation: 333mW; .Creator: GP; Category: Resistor; ComponentLink1Description: Datasheet; ComponentLink1URL: https://docs.rs-online.com/ef78/0900766b812cb812.pdf; ComponentLink2Description: Where buy it; ComponentLink2URL: https://es.rs-online.com/web/p/resistencias-de-montaje-en-superficie/7218936; Supplier 1: RSComponents; Manufacturer Part Number: ERJT08J102V; RoHS: Yes; Stock 1: 1; Pricing 1: 5=0,32200, 50=0,30000, 100=0,28100, 250=0,25900, 500=0,23800 (USD); Mount: Surface Mount; Case/Package: 1206; Number of Pins: 2; Contact Plating: Tin; Case Code (Metric): 3216; Case Code (Imperial): 1206; Min Operating Temperature: -55°C; Max Operating Temperature: 155°C; Tolerance: 5%; Resistor Type: Thick Film; Package Quantity: 5000; Packaging: Tape and Reel; Number of Terminations: 2; Voltage Rating (DC): 200V; Termination: Tab; Features: Automotive AEC-Q200; Length: 3.2mm; Width: 0.063inch; Height: 0.6mm; Depth: 1.6mm; Radiation Hardening: No; REACH SVHC: No SVHC; Military Standard: Not; RoHS Compliant: Yes; Supplier Part Number 1: 7218936
R24 = R1k-0805FTK: Res Thick Film 0805 1K Ohm 5% 1/8W ±200ppm/°C Molded SMD SMD Paper Tape on Plastic Reel; Manufacturer 1: Bourns; Voltage Rating (DC): 150V; Power Rating: 125mW; .Creator: GP; Supplier 1: Arrow Electronics; Manufacturer Part Number 1: CR0805-JW-102ELF; RoHS: Yes; Category: Chip SMD Resistors; Stock 1: 27510; Pricing 1: 1=0,05930, 10=0,03510, 25=0,01790, 100=0,00800, 250=0,00790, 500=0,00590, 1000=0,00360, 3000=0,00350, 6000=0,00250 (USD); Mount: Surface Mount; Case/Package: 0805; Number of Pins: 2; Contact Plating: Tin; Case Code (Metric): 2012; Case Code (Imperial): 0805; Min Operating Temperature: -55°C; Max Operating Temperature: 155°C; Resistor Type: Thick Film; Tolerance: 5%; Temperature Coefficient: 200ppm/°C; Features: Moisture Resistant; Package Quantity: 1; Packaging: Tape and Reel; Voltage Rating: 150V; Number of Terminations: 2; Termination: SMD/SMT; Max Power Dissipation: 125mW; Length: 2mm; Width: 1.25mm; Height: 0.5mm; Thickness: 508um; Depth: 1.25mm; Radiation Hardening: No; Lead Free: Lead Free; REACH SVHC: No SVHC; Military Standard: Not; ComponentLink1URL: https://datasheet.ciiva.com/11821/0900766b80fcdb72-11821134.pdf?src-supplier=RSComponents; ComponentLink1Description: https://datasheet.ciiva.com/11821/0900766b80fcdb72-11821134.pdf?src-supplier=RSComponents; ComponentLink2URL: https://datasheet.ciiva.com/15225/getdatasheetpartid-78155-15225381.pdf?src-supplier=Verical; ComponentLink2Description: https://datasheet.ciiva.com/15225/getdatasheetpartid-78155-15225381.pdf?src-supplier=Verical; ComponentLink3URL: https://datasheet.ciiva.com/22693/1902866-22693253.pdf?src-supplier=Element14; ComponentLink3Description: https://datasheet.ciiva.com/22693/1902866-22693253.pdf?src-supplier=Element14; ComponentLink4URL: https://datasheet.ciiva.com/7986/1856384-7986184.pdf?src-supplier=Element14; ComponentLink4Description: https://datasheet.ciiva.com/7986/1856384-7986184.pdf?src-supplier=Element14; ComponentLink5URL: https://datasheet.ciiva.com/7985/1856384-7985867.pdf?src-supplier=Element14; ComponentLink5Description: https://datasheet.ciiva.com/7985/1856384-7985867.pdf?src-supplier=Element14; ComponentLink6URL: https://datasheet.ciiva.com/30242/159chpreztr-30242765.pdf?src-supplier=Onlinecomponents.com; ComponentLink6Description: https://datasheet.ciiva.com/30242/159chpreztr-30242765.pdf?src-supplier=Onlinecomponents.com; ComponentLink7URL: https://datasheet.ciiva.com/6547/chpreztr-6547359.pdf?src-supplier=Digi-Key; ComponentLink7Description: https://datasheet.ciiva.com/6547/chpreztr-6547359.pdf?src-supplier=Digi-Key; Supplier Part Number 1: CR0805-JW-102ELF
TP1-TP27 = TestPoint: Test Point 1x1 mm; .Creator: GP; Category: TestPoint; .PCBcheck: GP; .SCHcheck: GP
U1 = LDO_35V-1/12V-TO220: 1.5-A, 35-V, linear voltage regulator 3-TO-220 -40 to 125; Manufacturer: Texas Instruments; Dropout Voltage: 2V; Quiescent Current: 8mA; Number of Outputs: 1; Max Input Voltage: 35V; Max Output Current: 1A; Output Voltage: 12V; Polarity: Positive; Accuracy: 2%; Output Type: Fixed; .Creator: AC; Supplier 1: Digi-Key; RoHS: Yes; Category: Voltage Regulators - Linear; Pricing 1: 1=1,97000, 10=1,76700, 25=1,66680, 100=1,42020, 250=1,33348, 500=1,16680, 1000=1,10075 (USD); Mount: Through Hole; Case/Package: TO-220; Number of Pins: 3; Min Operating Temperature: -40°C; Max Operating Temperature: 125°C; Packaging: Rail/Tube; Output Current: 1A; Package Quantity: 45; Output Voltage Accuracy: 2%; Series: LM340-N; Voltage: 12V; Length: 10.16mm; Width: 4.7mm; Height: 8.89mm; Radiation Hardening: No; Lead Free: Lead Free; RoHS Compliant: Yes; ComponentLink1URL: https://datasheet.ciiva.com/16490/lm340-n-16490133.pdf?src-supplier=Avnet+Asia; ComponentLink1Description: https://datasheet.ciiva.com/16490/lm340-n-16490133.pdf?src-supplier=Avnet+Asia; Supplier Part Number 1: 296-50628-ND; ComponentLink2Description: Where buy it; ComponentLink2URL: https://es.rs-online.com/web/p/reguladores-de-tension/1977323; Manufacturer Part Number: LM340S-12/NOPB
U2 U3 = Array_4_Comp_LM339D: Comparator Quad ±18V/36V 14-Pin SOIC Tube; Manufacturer: Texas Instruments; Number of Channels: 4; Nominal Supply Current: 2mA; Output Current: 20mA; Quiescent Current: 2.5mA; Max Supply Voltage: 30V; Min Supply Voltage: 2V; Min Dual Supply Voltage: 1V; Max Dual Supply Voltage: 15V; Voltage Gain: 106.02dB; Max Supply Current: 500uA; Input Bias Current: 250nA; Output Current per Channel: 6mA; Input Offset Voltage (Vos): 5mV; Response Time: 0.3us; Output Type: TTL; Dual Supply Voltage: 9V; .Creator: DO; Supplier 1: Digi-Key; RoHS: Yes; Category: Amplifiers - Op Amps, Buffer, Instrumentation; Stock 1: 10834; Pricing 1: 1=0,93000, 10=0,83500, 25=0,79240, 100=0,65090, 250=0,60848, 500=0,53774, 1000=0,46725 (USD); Mount: Surface Mount; Case/Package: SOIC; Number of Pins: 14; Contact Plating: Gold; Weight: 0.004318oz; Min Operating Temperature: 0°C; Max Operating Temperature: 70°C; Packaging: Rail/Tube; Package Quantity: 50; Number of Elements: 4; Supply Current: 2mA; Technology: BIPOLAR; Max Input Current: 250nA; Series: LM339; Length: 8.65mm; Width: 3.91mm; Height: 1.58mm; Radiation Hardening: No; REACH SVHC: No SVHC; Lead Free: Lead Free; RoHS Compliant: Yes; ComponentLink1URL: https://datasheet.ciiva.com/15131/getdatasheetpartid-248452-15131099.pdf?src-supplier=Verical; ComponentLink1Description: https://datasheet.ciiva.com/15131/getdatasheetpartid-248452-15131099.pdf?src-supplier=Verical; ComponentLink2URL: https://datasheet.ciiva.com/1483/1831045-1483000.pdf?src-supplier=Element14; ComponentLink2Description: https://datasheet.ciiva.com/1483/1831045-1483000.pdf?src-supplier=Element14; ComponentLink3URL: https://datasheet.ciiva.com/1827/lm139a-1827534.pdf?src-supplier=Digi-Key; ComponentLink3Description: https://datasheet.ciiva.com/1827/lm139a-1827534.pdf?src-supplier=Digi-Key; ComponentLink4URL: https://datasheet.ciiva.com/2970/lm2901-2970484.pdf?src-supplier=Avnet; ComponentLink4Description: https://datasheet.ciiva.com/2970/lm2901-2970484.pdf?src-supplier=Avnet; ComponentLink5URL: https://datasheet.ciiva.com/48712/001010753-da-01-en-ic-quad-diff-comp-lm339d-soic-14-tid-48712470.pdf?src-supplier=Conrad; ComponentLink5Description: https://datasheet.ciiva.com/48712/001010753-da-01-en-ic-quad-diff-comp-lm339d-soic-14-tid-48712470.pdf?src-supplier=Conrad; Supplier Part Number 1: 296-1013-5-ND; ComponentLink6Description: Where buy it; ComponentLink6URL: https://es.rs-online.com/web/p/comparadores/0858411; Manufacturer Part Number: LM339D
X1 = Relay_G5V-1-DC5: Electromechanical Relay SPDT 1A 5VDC 167Ohm Through Hole; Manufacturer: Omron; Max Voltage Rating (AC): 125V; Max Voltage Rating (DC): 60V; Coil Current: 30mA; Operate Time: 5ms; Coil Power: 150mW; Coil Resistance: 167R; Coil Type: Non-Latching; Coil Voltage (DC): 5V; Number of Poles: 1; Relay Type: General Purpose; Insulation Resistance: 1GR; Approvals: UL,CSA; .Creator: DO; Supplier 1: Avnet; Manufacturer Part Number: G5V-1-DC5; RoHS: Yes; Category: Signal Relays; Stock 1: 10; Pricing 1: 1=1,32941, 10=1,30681, 30=1,28421, 50=1,25430, 100=1,24300 (USD); Mount: Through Hole,PCB; Case/Package: DIP; Number of Pins: 6; Contact Material: Gold,Silver; Min Operating Temperature: -40°C; Max Operating Temperature: 70°C; Contact Current Rating: 1A; Max Current Rating: 1A; Throw Configuration: SPDT; Termination: PC Pin; Packaging: Bulk; Power Consumption: 150mW; Package Quantity: 25; Voltage Rating (AC): 125V; Voltage Rating (DC): 60V; Release Time: 5ms; Current Rating: 1A; Type: Electromechanical; Length: 12.5mm; Width: 7.5mm; Height: 10mm; Depth: 7.5mm; Radiation Hardening: No; REACH SVHC: Unknown; Lead Free: Lead Free; ComponentLink1URL: https://datasheet.ciiva.com/1525/96550-1525281.pdf?src-supplier=Element14; ComponentLink1Description: https://datasheet.ciiva.com/1525/96550-1525281.pdf?src-supplier=Element14; ComponentLink2URL: https://datasheet.ciiva.com/19455/187240-19455238.pdf?src-supplier=Jameco; ComponentLink2Description: https://datasheet.ciiva.com/19455/187240-19455238.pdf?src-supplier=Jameco; ComponentLink3URL: https://datasheet.ciiva.com/26921/getdatasheetpartid-765626-26921061.pdf?src-supplier=Verical; ComponentLink3Description: https://datasheet.ciiva.com/26921/getdatasheetpartid-765626-26921061.pdf?src-supplier=Verical; ComponentLink4URL: https://datasheet.ciiva.com/18421/70175634-18421511.pdf?src-supplier=Allied+Electronics; ComponentLink4Description: https://datasheet.ciiva.com/18421/70175634-18421511.pdf?src-supplier=Allied+Electronics; ComponentLink5URL: https://datasheet.ciiva.com/15718/g5v-1-15718184.pdf?src-supplier=Onlinecomponents.com; ComponentLink5Description: https://datasheet.ciiva.com/15718/g5v-1-15718184.pdf?src-supplier=Onlinecomponents.com; ComponentLink6URL: https://datasheet.ciiva.com/2416/g5v-1-0911-2416495.pdf?src-supplier=Digi-Key; ComponentLink6Description: https://datasheet.ciiva.com/2416/g5v-1-0911-2416495.pdf?src-supplier=Digi-Key; ComponentLink7URL: https://datasheet.ciiva.com/30083/en-g5v-1-30083503.pdf?src-supplier=Onlinecomponents.com; ComponentLink7Description: https://datasheet.ciiva.com/30083/en-g5v-1-30083503.pdf?src-supplier=Onlinecomponents.com; ComponentLink8Description: Where buy it; ComponentLink8URL: https://es.rs-online.com/web/p/reles-sin-enclavamiento/8411420/?relevancy-data=7365617263685F636173636164655F6F726465723D31267365617263685F696E746572666163655F6E616D653D4931384E53656172636847656E65726963267365617263685F6C616E67756167655F757365643D6573267365617263685F6D617463685F6D6F64653D6D61746368616C6C7061727469616C267365617263685F7061747465726E5F6D6174636865643D5E5B5C707B4C7D5C707B4E647D2D2C2F255C2E5D2B24267365617263685F7061747465726E5F6F726465723D313333267365617263685F73745F6E6F726D616C697365643D59267365617263685F726573706F6E73655F616374696F6E3D267365617263685F747970653D4B4559574F52445F53494E474C455F414C5048415F4E554D45524943267365617263685F7370656C6C5F636F72726563745F6170706C6965643D59267365617263685F77696C645F63617264696E675F6D6F64653D4E4F4E45267365617263685F6B6579776F72643D4735562D312D444335267365617263685F6B6579776F72645F6170703D4735562D312D444335267365617263685F636F6E6669673D3126&searchHistory=%7B%22enabled%22%3Atrue%7D; Supplier Part Number 1: G5V-1-DC5